# Altium project Zegar_HMI.PrjPcb
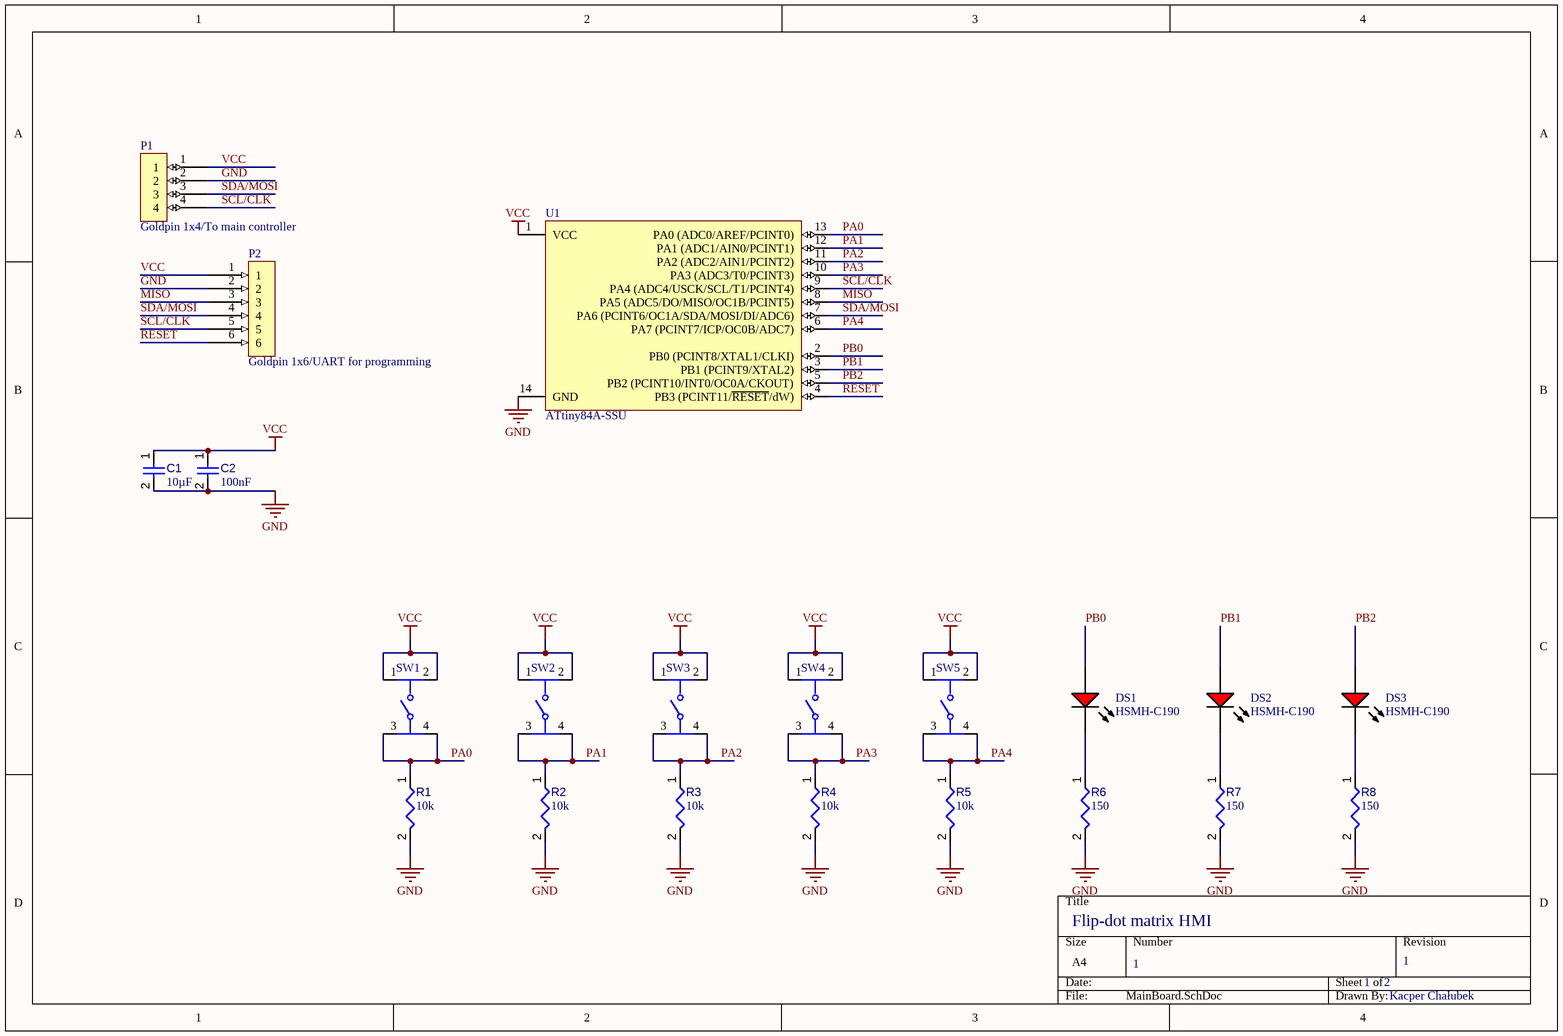
[diagram p0: MainBoard.SchDoc]
1 sheet, 21 parts. Net scope: global (net labels, ports and power ports of the same name join across sheets).
Board file: PCB1.PcbDoc

## Sheet MainBoard.SchDoc: Flip-dot matrix HMI
size A4; DrawnBy: Kacper Chałubek; DocumentNumber: 1; Revision: 1; SheetNumber: 1; SheetTotal: 2

### Parts
C1  value 10µF  [CAPC0603(1608)100_L]  (hidden comment: Capacitor 10µF +/-20% 10V 0603)
C2  value 100nF  [CAPC1608X90X40NL10T20]  (hidden comment: Capacitor 100 nF +/-10% 50 V 0603)
DS1  HSMH-C190  [AVAG-HSMX-C190_V]
DS2  HSMH-C190  [AVAG-HSMX-C190_V]
DS3  HSMH-C190  [AVAG-HSMX-C190_V]
P1  Goldpin 1x4/To main controller  [Goldpin 1x4-Footprint-1]
P2  Goldpin 1x6/UART for programming  [Goldpin 1x6-Footprint-1]
R1  value 10k  [RESC2013X50X35ML15T15]  (hidden comment: Resistor 10k +/-1% 0805 125 mW)
R2  value 10k  [RESC2013X50X35ML15T15]  (hidden comment: Resistor 10k +/-1% 0805 125 mW)
R3  value 10k  [RESC2013X50X35ML15T15]  (hidden comment: Resistor 10k +/-1% 0805 125 mW)
R4  value 10k  [RESC2013X50X35ML15T15]  (hidden comment: Resistor 10k +/-1% 0805 125 mW)
R5  value 10k  [RESC2013X50X35ML15T15]  (hidden comment: Resistor 10k +/-1% 0805 125 mW)
R6  value 150  [RESC2013X50X35ML15T15]  (hidden comment: Resistor 10k +/-1% 0805 125 mW)
R7  value 150  [RESC2013X50X35ML15T15]  (hidden comment: Resistor 10k +/-1% 0805 125 mW)
R8  value 150  [RESC2013X50X35ML15T15]  (hidden comment: Resistor 10k +/-1% 0805 125 mW)
SW1  PTS645SM43SMTR92LFS  [FP-PTS645SM43SMTR92LFS-MFG]  (value not drawn)
SW2  PTS645SM43SMTR92LFS  [FP-PTS645SM43SMTR92LFS-MFG]  (value not drawn)
SW3  PTS645SM43SMTR92LFS  [FP-PTS645SM43SMTR92LFS-MFG]  (value not drawn)
SW4  PTS645SM43SMTR92LFS  [FP-PTS645SM43SMTR92LFS-MFG]  (value not drawn)
SW5  PTS645SM43SMTR92LFS  [FP-PTS645SM43SMTR92LFS-MFG]  (value not drawn)
U1  ATtiny84A-SSU  [14S1_M]

### Nets
GND: C1.2 C2.2 P1.2 P2.2 R1.2 R2.2 R3.2 R4.2 R5.2 R6.2 R7.2 R8.2 U1.14(GND)
VCC: C1.1 C2.1 P1.1 P2.1 SW1.1 SW1.2 SW2.1 SW2.2 SW3.1 SW3.2 SW4.1 SW4.2 SW5.1 SW5.2 U1.1(VCC)
MISO: P2.3 U1.8(PA5_(ADC5/DO/MISO/OC1B/PCINT5))
PA0: R1.1 SW1.3 SW1.4 U1.13(PA0_(ADC0/AREF/PCINT0))
PA1: R2.1 SW2.3 SW2.4 U1.12(PA1_(ADC1/AIN0/PCINT1))
PA2: R3.1 SW3.3 SW3.4 U1.11(PA2_(ADC2/AIN1/PCINT2))
PA3: R4.1 SW4.3 SW4.4 U1.10(PA3_(ADC3/T0/PCINT3))
PA4: R5.1 SW5.3 SW5.4 U1.6(PA7_(PCINT7/ICP/OC0B/ADC7))
PB0: DS1.1(A) U1.2(PB0_(PCINT8/XTAL1/CLKI))
PB1: DS2.1(A) U1.3(PB1_(PCINT9/XTAL2))
PB2: DS3.1(A) U1.5(PB2_(PCINT10/INT0/OC0A/CKOUT))
RESET: P2.6 U1.4(PB3_(PCINT11/~{RESET}/dW))
SCL/CLK: P1.4 P2.5 U1.9(PA4_(ADC4/USCK/SCL/T1/PCINT4))
SDA/MOSI: P1.3 P2.4 U1.7(PA6_(PCINT6/OC1A/SDA/MOSI/DI/ADC6))
NetDS1_2: DS1.2(K) R6.1
NetDS2_2: DS2.2(K) R7.1
NetDS3_2: DS3.2(K) R8.1

### Library data of the parts
C1 = CMP-001-00075-4: Chip Capacitor, 10µF +/-20%, 10V, 0603, Thickness 1 mm; Tolerance: 10%; Voltage Rating: 10V; Max Operating Temperature: 85°C; Pins: 2; Case/Package: 0603; Mounting Technology: SMT; Min Operating Temperature: -55°C
C2 = CMP-001-00017-6: Chip Capacitor, 100 nF, +/- 10%, 50 V, 0603 (1608 Metric); Voltage Rating: 50V; Capacitor Type: Ceramic; Tolerance: 10%; Mounting Technology: SM; Max Operating Temperature: 125°C; RoHS Compliant: True; Pins: 2; Case/Package: 0603; Min Operating Temperature: -55°C
DS1-DS3 = CMP-007-00014-2: LED Uni-Color Red, 65 mW, 20 mA, -40 to 85 degC, 2-Pin SMD, RoHS, Tape and Reel; Manufacturer: Avago; Nominal Vf: 1.8V; Luminous Intensity: 17mcd; Power: 78mW; Forward Current: 20mA; Lens Style: Diffused; Viewing Angle: 170degrees; Package Quantity: 4000; Colour: Red; Manufacturer URL: http://www.avagotech.com/; Min Operating Temperature: -40°C; Datasheet URL: http://docs.avagotech.com/docs/AV02-0551EN; RoHS Compliant: True; Forward Voltage: 1.8V; Pins: 2; Max Operating Temperature: 85°C; Packaging: TapeandReel; Package Reference: HSMX-C190; Datasheet Version: Mar-12; Package Description: 2-Pin Surface Mount Device, Body 1.6 x 0.8 mm, Height 0.9 mm; Case/Package: 0603; Mounting Technology: SM; Illumination Colour: Red
P1 = CMP-002-00078-2: Goldpin, connector, 1 row 4 pin
P2 = CMP-002-00081-1: Goldpin, connector, 1 row 6 pin
R1-R8 = CMP-009-00018-5: Chip Resistor, 10 KOhm, +/- 1%, 125 mW, -55 to 155 degC, 0805 (2012 Metric); Power: 125mW; Voltage Rating: 150V; Min Operating Temperature: -55°C; Mounting Technology: SM; Pins: 2; Case/Package: 0805; Tolerance: 1%; RoHS Compliant: True; Max Operating Temperature: 155°C
SW1-SW5 = CMP-2000-05160-2: SWITCH TACTILE SPST-NO 0.05A 12V; Contact Resistance: 100mR; Throw Configuration: SPST; Illumination Type: Non-Illuminated; Mechanical Life: 100000Cycles; Current Rating: 50mA; Switch Function: Off-Mom; Actuator Length: 0.85mm; Actuator Material: Nylon; Actuator Type: Standard; Operating Force: 160gf; Min Operating Temperature: -20°C; REACH SVHC: No SVHC; Termination: Gull Wing; Case/Package: SMD/SMT; Packaging: Tape and Reel; Mount: Surface Mount; Voltage Rating (DC): 12V; Orientation: Straight; Lead Free: Lead Free; Contact Material: Silver; Color: Black; Max Current Rating: 50mA; Contact Plating: Silver; Depth: 9mm; Package Quantity: 1; Max Voltage Rating (DC): 12V; Length: 6mm; Max Operating Temperature: 60°C
U1 = CMP-0093-00274-1: 8-bit AVR Microcontroller,  20MHz, 1.8-5.5V, 8KB Flash, 512 Bytes EEPROM, 512 Bytes SRAM, 14-pin SOIC, Industrial Grade (-40°C to 85°C), Pb-Free; ComponentLink3URL: http://www.atmel.com/dyn/resources/prod_documents/8183S.pdf; ComponentLink2Description: ATtiny24A/44A/84A Datasheet; PackageReference: 14S1; Code_JEDEC: MS-012-AB; ComponentLink1URL: http://www.atmel.com/; ComponentLink3Description: ATtiny24A/44A/84A Summary; ComponentLink2URL: http://www.atmel.com/dyn/resources/prod_documents/doc8183.pdf; ComponentLink1Description: Manufacturer URL; DatasheetVersion: revD, Apr-2011; Code_IPC: SOIC127P600-14; PackageDescription: 14-Lead, 0.150â€ Wide Body, Plastic Gull Wing Small Outline Package (SOIC); PackageVersion: revA, Feb-2002